# EAGLE design uradmonitor_D.100.61 (EAGLE 6.1)
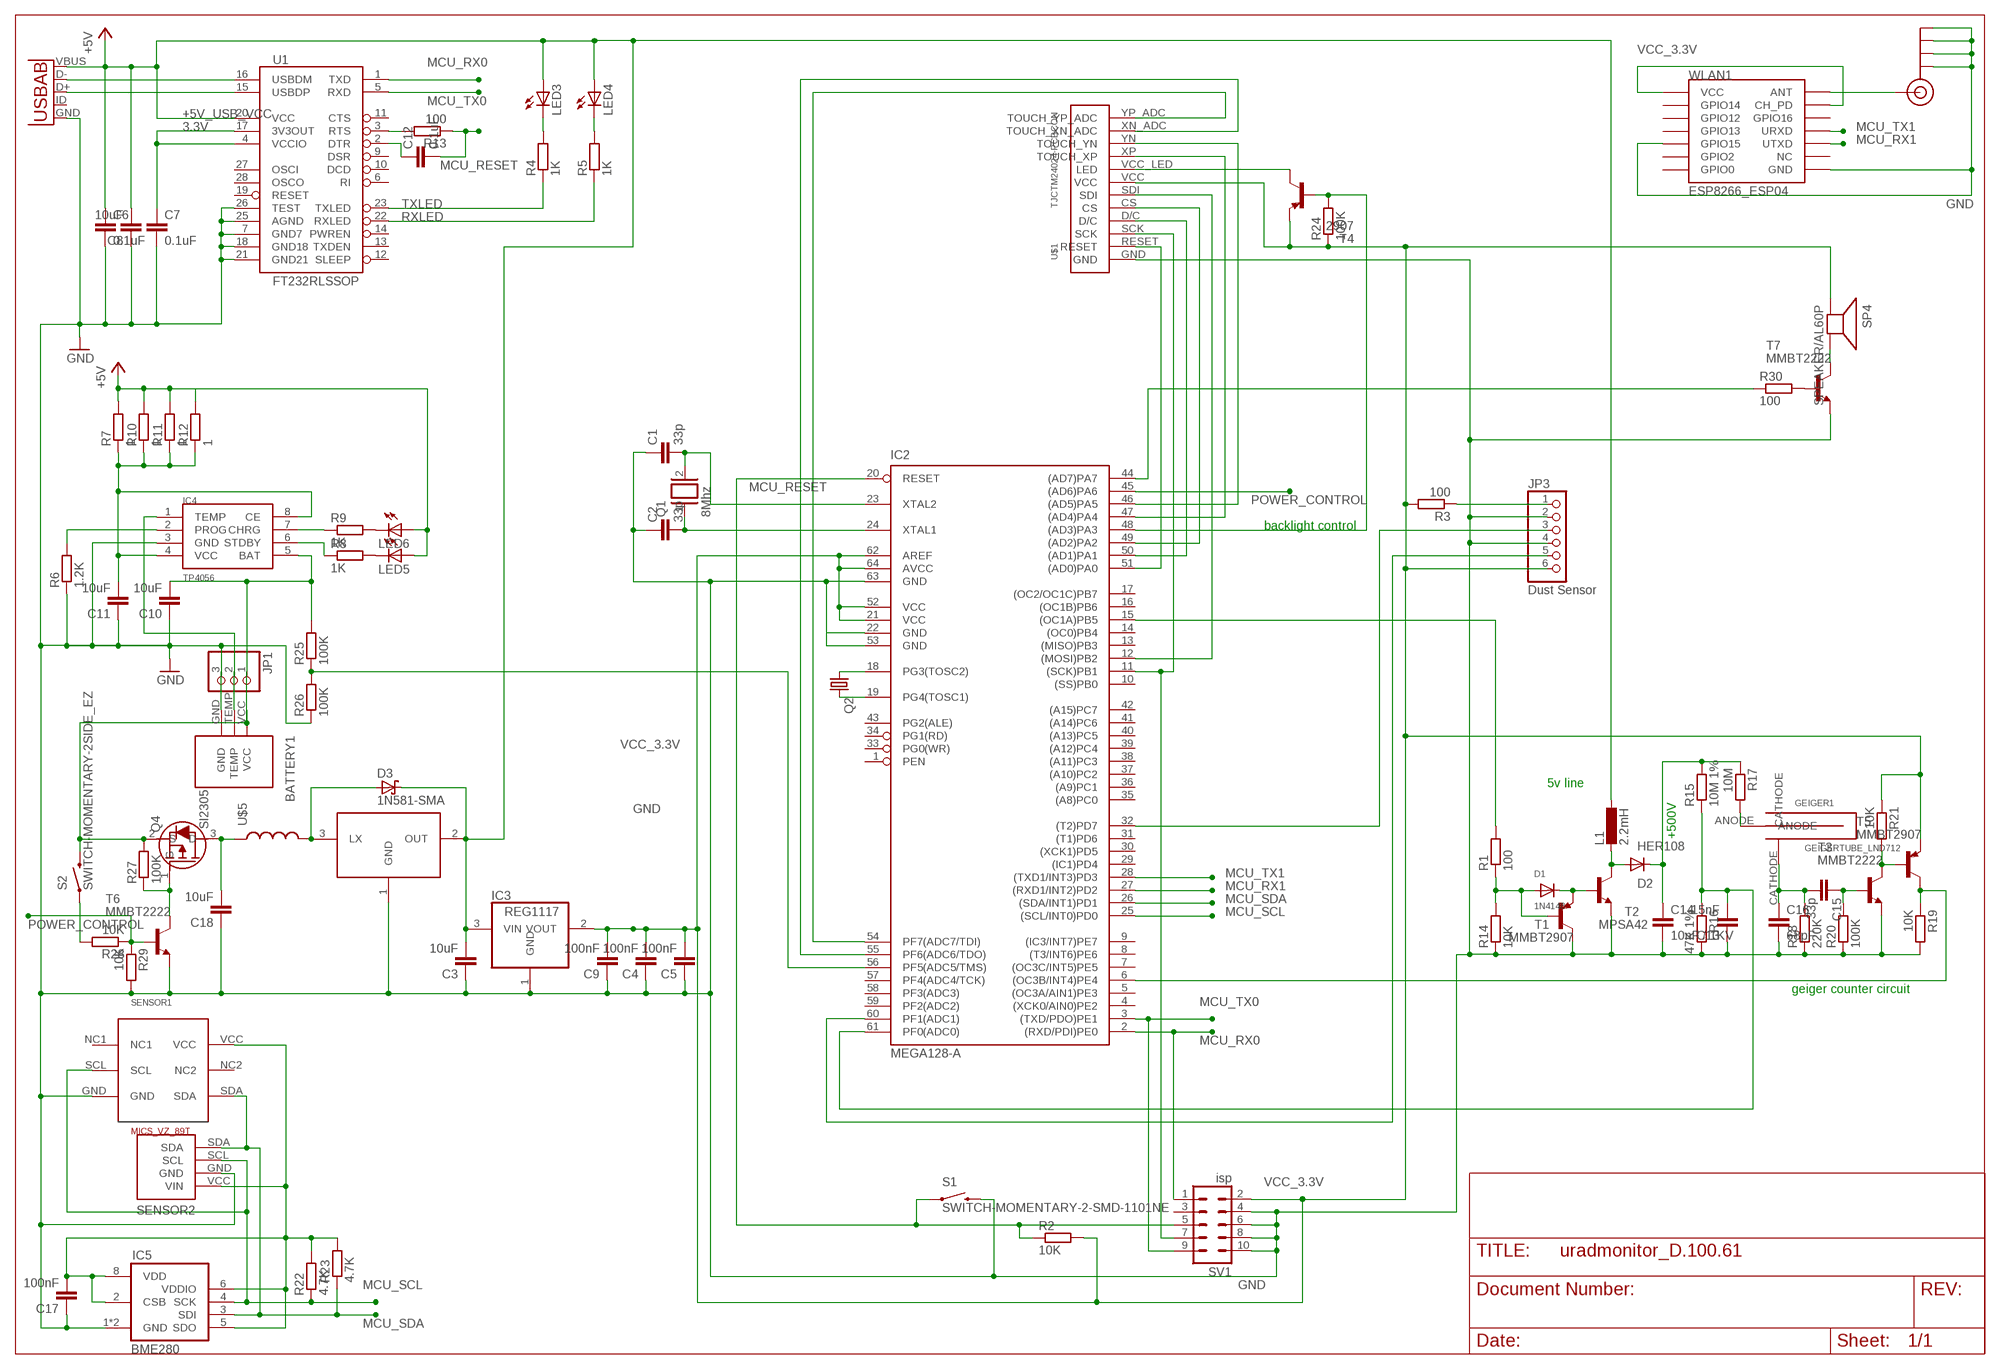
[diagram p0: schematic, sheet 1]

## Parts
BATTERY1  BAT-CASIO-NP40BATTERY  [BAT-CASIO-NP40]
C1  33p  C-EUC0805K  [C0805K]
C2  33p  C-EUC0805K  [C0805K]
C3  10uF  C-EUC0805K  [C0805K]
C4  100nF  C-EUC0805K  [C0805K]
C5  100nF  C-EUC0805K  [C0805K]
C6  0.1uF  CAP0805  [0805]
C7  0.1uF  CAP0805  [0805]
C8  10uF  C-EUC0805K  [C0805K]
C9  100nF  C-EUC0805K  [C0805K]
C10  10uF  C-EUC0805K  [C0805K]
C11  10uF  C-EUC0805K  [C0805K]
C12  0.1uF  CAP0805  [0805]
C13  15nF  C-EUC0805K  [C0805K]
C14  10nF / 1KV  C-EU050-025X075  [C050-025X075]
C15  33p  C-EUC0805K  [C0805K]
C16  68pF  C-EUC0805K  [C0805K]
C17  100nF  C-EUC0805K  [C0805K]
C18  10uF  C-EUC0805K  [C0805K]
D1  1N4148  DIODESOD-323F  [SOD-323F]
D2  HER108  DIODE-DO-214AC  [DO-214AC]
D3  1N581-SMA  [SMA-DIODE]
GEIGER1  GEIGERTUBE_LND712  [GEIGERTUBE_LND712]
IC2  MEGA128-A  [TQFP64]
IC3  REG1117  [SOT223]
IC4  TP4056  [TP4056]
IC5  BME280  [BME280]
J$1  SMA_EDGE  [SMA-EDGE]
JP1  PINHD-1X3  [1X03]
JP3  Dust Sensor  PINHD-1X6CB  [1X06-CLEANBIG]
L1  2.2mH  L-EUL1812  [L1812]
LED3  LEDCHIP-LED0805  [CHIP-LED0805]
LED4  LEDCHIP-LED0805  [CHIP-LED0805]
LED5  LED3MM  [LED3MM]
LED6  LED3MM  [LED3MM]
Q1  8Mhz  XTAL/S  [QS]
Q2  CRYSTALTC26H  [TC26H]
Q4  SI2305  [SOT23]
R1  100  R-EU_R0805  [R0805]
R2  10K  R-EU_R0805  [R0805]
R3  100  R-EU_R0805  [R0805]
R4  1K  R-EU_R0805  [R0805]
R5  1K  R-EU_R0805  [R0805]
R6  1.2K  R-EU_R0805  [R0805]
R7  1  R-EU_R0805  [R0805]
R8  1K  R-EU_R0805  [R0805]
R9  1K  R-EU_R0805  [R0805]
R10  1  R-EU_R0805  [R0805]
R11  1  R-EU_R0805  [R0805]
R12  1  R-EU_R0805  [R0805]
R13  100  R-EU_R0805  [R0805]
R14  10K  R-EU_R0805  [R0805]
R15  10M 1%  R-EU_0204/7  [0204/7]
R16  47K 1%  R-EU_R0805  [R0805]
R17  10M  R-EU_0204/7  [0204/7]
R18  220K  R-EU_0204/7  [0204/7]
R19  10K  R-EU_R0805  [R0805]
R20  100K  R-EU_R0805  [R0805]
R21  10K  R-EU_R0805  [R0805]
R22  4.7K  R-EU_R0805  [R0805]
R23  4.7K  R-EU_R0805  [R0805]
R24  100K  R-EU_R0805  [R0805]
R25  100K  R-EU_R0805  [R0805]
R26  100K  R-EU_R0805  [R0805]
R27  100K  R-EU_R0805  [R0805]
R28  10K  R-EU_R0805  [R0805]
R29  10K  R-EU_R0805  [R0805]
R30  100  R-EU_R0805  [R0805]
S1  SWITCH-MOMENTARY-2-SMD-1101NE  [TACTILE-SWITCH-1101NE]
S2  SWITCH-MOMENTARY-2SIDE_EZ  [TACTILE-PTH-SIDEEZ]
SENSOR1  MICS_VZ_89T  [MICS_VZ_89T]
SENSOR2  SENSOR_GY68GY-86DIP  [SENSOR_GY68]
SP4  SPEAKER/AL60P  [AL60P]
SV1  isp  MA05-2  [MA05-2]
T1  MMBT2907  MMBT2907ALT1-PNP-SOT23-BEC  [SOT23-BEC]
T2  MPSA42  MMBTA42LT1-NPN-SOT23-BEC  [SOT23-BEC]
T3  MMBT2222  MMBT2222ALT1-NPN-SOT23-BEC  [SOT23-BEC]
T4  2907  MMBT2907ALT1-PNP-SOT23-BEC  [SOT23-BEC]
T5  MMBT2907  MMBT2907ALT1-PNP-SOT23-BEC  [SOT23-BEC]
T6  MMBT2222  MMBT2222ALT1-NPN-SOT23-BEC  [SOT23-BEC]
T7  MMBT2222  MMBT2222ALT1-NPN-SOT23-BEC  [SOT23-BEC]
U1  FT232RLSSOP  [SSOP28DB]
U$1  TJCTM24024-PCBCON  [TJCTM24024-PCBCON]
U$2  USB_AB  [USB-AB-MICRO-SMD]
U$3  BL8530-SOT89-3  [SOT-89-3]
U$5  INDUCTOR-B82462G  [B82462G]
WLAN1  ESP8266_ESP04  [ESP8266_ESP04]

## Nets
3.3V [power]: C7.1 U1.4(VCCIO) U1.17(3V3OUT)
+5V_USB_VCC: C3.2 C6.1 C8.2 D3.C IC3.3(VIN) L1.1 LED3.A LED4.A LED5.A LED6.A R7.2 R10.2 R11.2 R12.2 U1.20(VCC) U$2.VBUS U$3.2(OUT) ; supply symbol labelled +5V
GND: BATTERY1.GND C1.1 C2.1 C3.1 C4.1 C5.1 C6.2 C7.2 C8.1 C9.1 C10.1 C11.1 C13.1 C14.2 C16.2 C17.1 C18.1 IC2.22(GND) IC2.53(GND) IC2.63(GND) IC3.1(GND) IC4.3(GND) IC5.1(GND) IC5.7(GND) J$1.GND@0(GND) J$1.GND@1(GND) J$1.GND@2(GND) J$1.GND@3(GND) JP1.3 JP3.2 JP3.4 R6.1 R14.1 R16.2 R18.1 R19.2 R20.1 R26.1 R29.2 S1.P$2 SENSOR1.GND SENSOR2.GND SV1.4 SV1.6 SV1.8 SV1.10 T1.C T2.E T3.E T6.E T7.E U1.7(GND7) U1.18(GND18) U1.21(GND21) U1.25(AGND) U1.26(TEST) U$1.GND U$2.GND U$3.1(GND) WLAN1.GND WLAN1.GPIO15
MCU_RESET: C12.2 IC2.20(RESET) R2.1 R13.1 S1.P$1 SV1.5
MCU_RX0: IC2.2((RXD/PDI)PE0) SV1.1 U1.1(TXD)
MCU_RX1: IC2.27((RXD1/INT2)PD2) WLAN1.UTXD
MCU_SCL: IC2.25((SCL/INT0)PD0) IC5.4(SCK) R22.1 SENSOR1.SCL SENSOR2.SCL
MCU_SDA: IC2.26((SDA/INT1)PD1) IC5.3(SDI) R23.1 SENSOR1.SDA SENSOR2.SDA
MCU_TX0: IC2.3((TXD/PDO)PE1) SV1.9 U1.5(RXD)
MCU_TX1: IC2.28((TXD1/INT3)PD3) WLAN1.URXD
N$1: J$1.SIG(SIGNAL) WLAN1.ANT
N$2: LED3.C R4.2
N$3: IC2.56(PF5(ADC5/TMS)) R25.1 R26.2
N$4: IC2.15((OC1A)PB5) R1.2
N$5: JP3.1 R3.1
N$6: IC2.11((SCK)PB1) SV1.7 U$1.SCK
N$7: LED4.C R5.2
N$8: D1.A R1.1 R14.2 T1.B
N$9: C1.2 IC2.23(XTAL2) Q1.2
N$11: C2.2 IC2.24(XTAL1) Q1.1
N$12: IC2.18(PG3(TOSC2)) Q2.1
N$13: T4.C U$1.VCC_LED(LED)
N$14: IC2.12((MOSI)PB2) U$1.SDI
N$15: U1.16(USBDM) U$2.D-
N$16: U1.15(USBDP) U$2.D+
N$17: D1.C T1.E T2.B
N$18: IC4.6(STDBY) R8.1
N$19: GEIGER1.ANODE R17.2
N$20: C15.1 R20.2 T3.B
N$21: IC4.7(CHRG) R9.1
N$22: LED6.K(C) R9.2
N$23: IC2.32((T2)PD7) JP3.3
N$24: LED5.K(C) R8.2
N$25: BATTERY1.VCC C10.2 IC4.5(BAT) JP1.1 Q4.2(S) R25.2 R27.2 S2.2
N$26: C12.1 U1.2(DTR)
N$27: IC4.2(PROG) R6.2
N$28: R13.2 U1.3(RTS)
N$29: C11.2 IC4.4(VCC) IC4.8(CE) R7.1 R10.1 R11.1 R12.1
N$30: IC2.19(PG4(TOSC1)) Q2.2
N$31: BATTERY1.TEMP IC4.1(TEMP) JP1.2
N$32: IC2.60(PF1(ADC1)) JP3.5
N$33: IC2.44((AD7)PA7) R30.1
N$35: D3.A U$3.3(LX) U$5.P$2
N$36: IC2.51((AD0)PA0) U$1.RESET
N$38: IC2.50((AD1)PA1) U$1.D/C
N$39: IC2.49((AD2)PA2) U$1.CS
N$40: IC2.47((AD4)PA4) U$1.XP(TOUCH_XP)
N$41: IC2.46((AD5)PA5) U$1.YN(TOUCH_YN)
N$42: C15.2 C16.1 GEIGER1.CATHODE R18.2
N$43: IC2.54(PF7(ADC7/TDI)) U$1.YP_ADC(TOUCH_YP_ADC)
N$44: IC2.55(PF6(ADC6/TDO)) U$1.XN_ADC(TOUCH_XN_ADC)
N$45: IC2.48((AD3)PA3) R24.2 T4.B
N$46: Q4.1(G) R27.1 T6.C
N$47: C18.2 Q4.3(D) U$5.P$1
N$48: R28.2 S2.1
N$51: D2.A L1.2 T2.C
N$54: C13.2 IC2.61(PF0(ADC0)) R15.1 R16.1
N$56: C14.1 D2.C R15.2 R17.1
N$57: R30.2 T7.B
N$59: R21.2 T3.C T5.B
N$60: IC2.6((OC3B/INT4)PE4) R19.1 T5.C
POWER_CONTROL: IC2.45((AD6)PA6) R28.1 R29.1 T6.B
RXLED: R5.1 U1.22(RXLED)
SOLDER_TUBE: SP4.2(-) T7.C
TXLED: R4.1 U1.23(TXLED)
VCC_3.3V: C4.2 C5.2 C9.2 C17.2 IC2.21(VCC) IC2.52(VCC) IC2.62(AREF) IC2.64(AVCC) IC3.2(VOUT) IC5.2(CSB) IC5.5(SDO) IC5.6(VDDIO) IC5.8(VDD) JP3.6 R2.2 R3.2 R21.1 R22.2 R23.2 R24.1 SENSOR1.VCC SENSOR2.VCC(VIN) SP4.1(+) SV1.2 T4.E T5.E U$1.VCC WLAN1.CH_PD WLAN1.VCC
Unconnected: IC2.1(PEN) IC2.4((XCK0/AIN0)PE2) IC2.5((OC3A/AIN1)PE3) IC2.7((OC3C/INT5)PE5) IC2.8((T3/INT6)PE6) IC2.9((IC3/INT7)PE7) IC2.10((SS)PB0) IC2.13((MISO)PB3) IC2.14((OC0)PB4) IC2.16((OC1B)PB6) IC2.17((OC2/OC1C)PB7) IC2.29((IC1)PD4) IC2.30((XCK1)PD5) IC2.31((T1)PD6) IC2.33(PG0(WR)) IC2.34(PG1(RD)) IC2.35((A8)PC0) IC2.36((A9)PC1) IC2.37((A10)PC2) IC2.38((A11)PC3) IC2.39((A12)PC4) IC2.40((A13)PC5) IC2.41((A14)PC6) IC2.42((A15)PC7) IC2.43(PG2(ALE)) IC2.57(PF4(ADC4/TCK)) IC2.58(PF3(ADC3)) IC2.59(PF2(ADC2)) SENSOR1.NC1 SENSOR1.NC2 SV1.3 U1.6(RI) U1.9(DSR) U1.10(DCD) U1.11(CTS) U1.12(SLEEP) U1.13(TXDEN) U1.14(PWREN) U1.19(RESET) U1.27(OSCI) U1.28(OSCO) U$2.ID(USBID) WLAN1.GPIO0 WLAN1.GPIO2 WLAN1.GPIO12 WLAN1.GPIO13 WLAN1.GPIO14 WLAN1.GPIO16 WLAN1.NC

## Notes on the sheet
- backlight control
- 5v line
- +500V
- geiger counter circuit

## Library data of the parts
BATTERY1 = uradmonitor:BAT-CASIO-NP40: Li-ion 3.7V 1500mAh battery , compatible with Casio-NP-40
C1-C5 C8-C11 C13-C18 = rcl:C-EU: CAPACITOR, European symbol
C6 C7 C12 = SparkFun:CAP: Capacitor Standard 0603 ceramic capacitor, and 0.1" leaded capacitor.
D1 = adafruit:DIODE: Diode SMADIODE - SMA Surface Mount Package 20V 1A Schottky Diode Digikey: 641-1014-6-ND DO-1N4148 - Through Hole Small Current Diode SOD-123 20V 1 A (.5mV Vf) Schottky Diode - Digikey: MBRX120TPMSCT-ND SOD-323 10V 570mA (.38mV Vf, 3ns) Schottky Diode - Digikey: ZLLS410CT-ND SOD-523 30V 30mA Schottky Diode (RB751S-40TE61) - Digikey: RB751S-40TE61CT-ND SOT23-R/W - SOT23 Package (R = Solder Paste/Reflow Ovens, W = Hand-Soldering) BAT54Film 40V 300mA - Digikey: 497-7162-1-ND
D2 = diode:DIODE-: DIODE
D3 = digital-toy:1N581*: 1.0A SCHOTTKY BARRIER RECTIFIER Source: http://www.diodes.com/datasheets/ds23001.pdf
GEIGER1 = uradmonitor:GEIGERTUBE_LND712
IC2 = atmel:MEGA128: MICROCONTROLLER 128 Kbytes FLASH 4 Kbytes SRAM 4 Kbytes EEPROM DUAL USART 8-channel 10 bit ADC Source: avr.lbr; MPN: ATMEGA128-16AU; OC_FARNELL: 9171118; OC_NEWARK: 95K7364
IC3 = burr-brown:REG1117: 800mA and 1A Low Dropout (LDO) Positive Regulator 1.8V, 2.5V, 2.85V, 3.3V, 5V, and Adj; MPN: REG1117; OC_FARNELL: 1097566; OC_NEWARK: 14P6981
IC4 = uradmonitor:TP4056
IC5 = uradmonitor:BME280: DIGITAL HUMIDITY, PRESSURE AND TEMPERATURE SENSOR * Digital interface IÂ²C (up to 3.4 MHz) and SPI (3 and 4 wire, up to 10 MHz)* Supply voltage VDD main supply voltage range: 1.71 V to 3.6 V*VDDIO interface voltage range: 1.2 V to 3.6 V Operating range -40â€¦+85 Â°C, 0â€¦100 % rel. humidity, 300â€¦1100 hPa
J$1 = sparkfun-connectors:SMA_EDGE: SMA Antenna Connector End launch SMA connector. The paste layer has been removed so that the connector can be hand soldered onto the board after reflow.
JP1 = adafruit:PINHD-1X3: PIN HEADER
JP3 = adafruit:PINHD-1X6: PIN HEADER
L1 = rcl:L-EU: INDUCTOR, European symbol
LED3-LED6 = adafruit:LED: LED OSRAM: - CHIPLED LG R971, LG N971, LY N971, LG Q971, LY Q971, LO R971, LY R971 LH N974, LH R974 LS Q976, LO Q976, LY Q976 LO Q996 - Hyper CHIPLED LW Q18S LB Q993, LB Q99A, LB R99A - SideLED LS A670, LO A670, LY A670, LG A670, LP A670 LB A673, LV A673, LT A673, LW A673 LH A674 LY A675 LS A676, LA A676, LO A676, LY A676, LW A676 LS A679, LY A679, LG A679 - Hyper Micro SIDELED® LS Y876, LA Y876, LO Y876, LY Y876 LT Y87S - SmartLED LW L88C, LW L88S LB L89C, LB L89S, LG L890 LS L89K, LO L89K, LY L89K LS L896, LA L896, LO L896, LY L896 - TOPLED LS T670, LO T670, LY T670, LG T670, LP T670 LSG T670, LSP T670, LSY T670, LOP T670, LYG T670 LG T671, LOG T671, LSG T671 LB T673, LV T673, LT T673, LW T673 LH T674 LS T676, LA T676, LO T676, LY T676, LB T676, LH T676, LSB T676, LW T676 LB T67C, LV T67C, LT T67C, LS T67K, LO T67K, LY T67K, LW E67C LS E67B, LA E67B, LO E67B, LY E67B, LB E67C, LV E67C, LT E67C LW T67C LS T679, LY T679, LG T679 LS T770, LO T770, LY T770, LG T770, LP T770 LB T773, LV T773, LT T773, LW T773 LH T774 LS E675, LA E675, LY E675, LS T675 LS T776, LA T776, LO T776, LY T776, LB T776 LHGB T686 LT T68C, LB T68C - Hyper Mini TOPLED® LB M676 - Mini TOPLED Santana® LG M470 LS M47K, LO M47K, LY M47K Source: http://www.osram.convergy.de/
Q1 = special:XTAL/S: CRYSTAL
Q2 = adafruit:CRYSTAL: CRYSTAL; OC_FARNELL: unknown; OC_NEWARK: unknown
Q4 = uradmonitor:SI2305: P-Channel 8 V (D-S) MOSFET
R1 R3 R14 R24 = resistor:R-EU_: RESISTOR, European symbol
R2 R4-R13 R15-R23 R25-R30 = rcl:R-EU_: RESISTOR, European symbol
S1 S2 = sparkfun-electromechanical:SWITCH-MOMENTARY-2: Various NO switches- pushbuttons, reed, etc
SENSOR1 = uradmonitor:MICS_VZ_89T: The MiCS-VZ-86/89 combines state-of-the-art MOS sensor technology with intelligent detection algorithms to monitor VOCs and CO2 equivalent variations in confined spaces
SENSOR2 = uradmonitor:SENSOR_GY68: GY-68 breadboard featuring 3.3V regulator and BMP180 sensor for 5V input.
SP4 = adafruit:SPEAKER: SPEAKER Source: Buerklin Added PS12 (for part # PS1240 piezo) http://www.ladyada.net/library/pcb/eaglelibrary.html
SV1 = con-lstb:MA05-2: PIN HEADER; OC_FARNELL: unknown; OC_NEWARK: unknown
T1 T4 T5 = transistor-neu-to92:*-PNP-: PNP Transistror
T2 T3 = transistor-neu-to92:*-NPN-: NPN Transistror BF959 corrected 2008.03.06
T6 T7 = transistor:*-NPN-: NPN Transistror BF959 corrected 2008.03.06
U1 = SparkFun:FT232RL: USB UART FT232RL 4th Generation USB UART (USB <-> Serial) Controller. Spark Fun Electronics SKU : COM-00650
U$1 = uradmonitor:TJCTM24024-PCBCON
U$2 = sparkfun-connectors:USB_AB: This is a USB AB connector that is compatible with USB OTG. i.e. this connector can serve as a host or device
U$3 = digital-toy:BL8530: PFC step-up DC boost for BL8530, rm04 and some other 3 pin boost. by hyl, 2011.4.11
U$5 = digital-toy:INDUCTOR: Inductors Basic Inductor/Choke - 0603 and 1206. Footprints are not proven and vary greatly between part numbers.
WLAN1 = uradmonitor:ESP8266_ESP04

## Net classes
1 power: width 0.254 mm

## Board
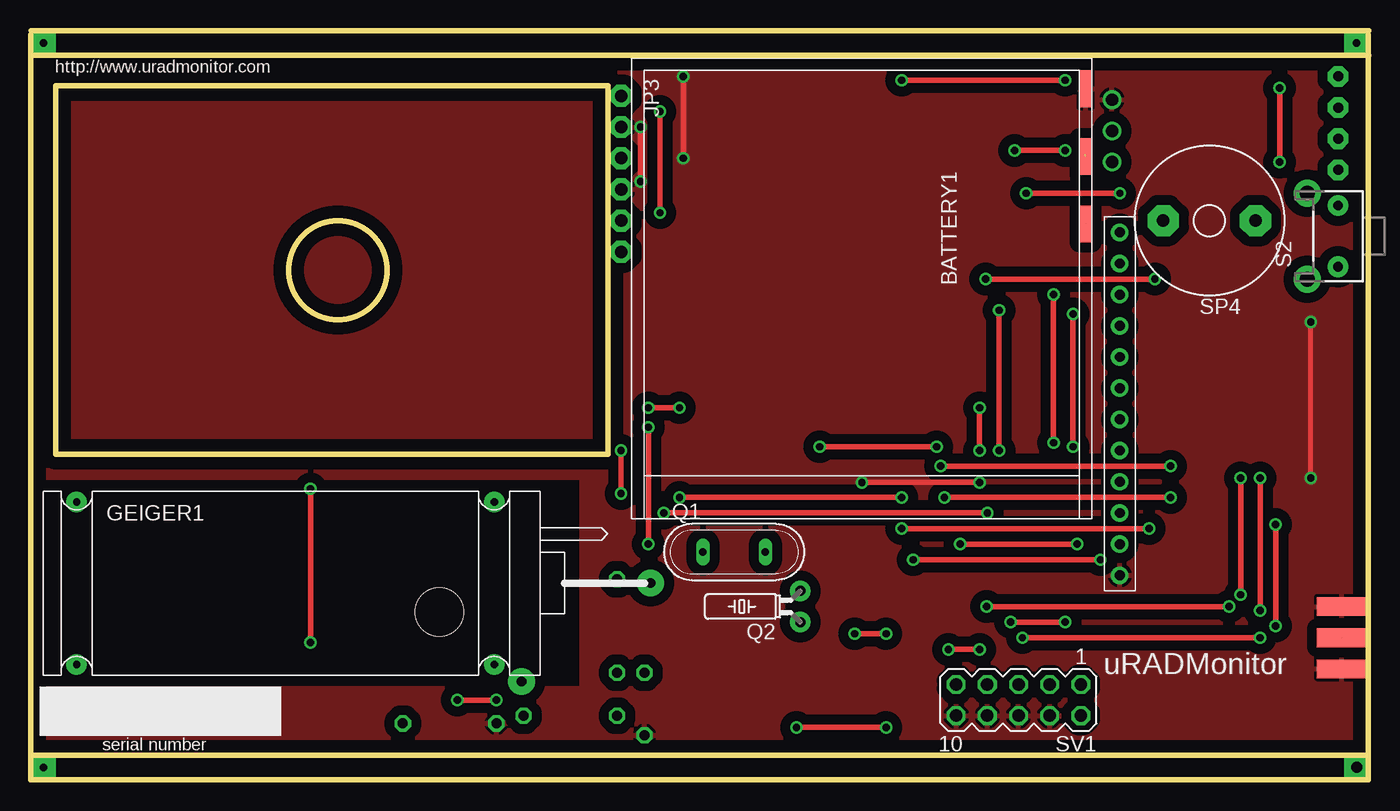
[diagram p1: board, top side]
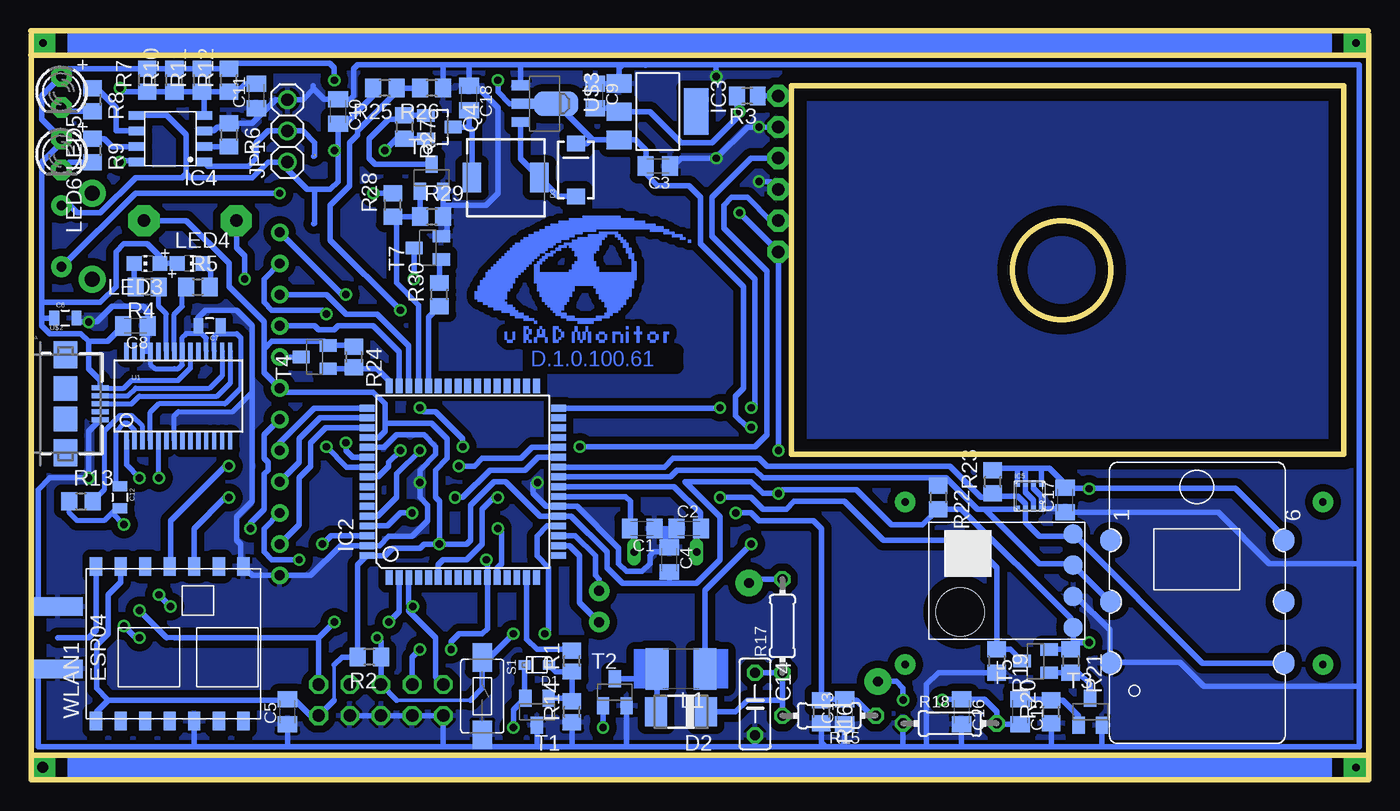
[diagram p2: board, bottom side, seen from below]

Size 109.03 x 61.03 mm. Coordinates in mm from the lower left corner, seen from the top.
Outline: 0,60.7 0,2
Outline: 0,2 0,0 109,0 109,2
Outline: 0,2 109,2
Outline: 0.03,61.03 54.53,61.03 109.03,61.03
Outline: 0.03,59.03 109.03,59.03
Outline: 109,2 109,60.7
Outline: 2.03,56.53 47.03,56.53 47.03,26.53 2.03,26.53 2.03,56.53
Outline: circle at 25.03,41.53 radius 4
Copper layers (1*16): Top 0.035mm / dielectric 1.5mm / Bottom 0.035mm
Design rules: minimum track width 10mil, minimum drill 24mil, track to track 8mil, track to pad 8mil, pad to pad 8mil, via to via 8mil, smd to smd 8mil, copper to edge 40mil, drill to drill 8mil, minimum pad ring 10mil, minimum via ring 8mil, stop-mask expansion 4mil, vias tented up to drill 0mil, thermal gap 10mil
Milling: area 2,26.5 to 47,56.5

### Footprints (pad centres in the part's own frame; a part is rotated, then mirrored left to right if it is on the bottom)
BAT-CASIO-NP40 = smd 3 x 1: GND 34.59,-36.85; TEMP 29.09,-36.85; VCC 23.59,-36.85
C0805K = smd 1.3 x 1.6: 1 -1,0; 2 1,0
0805 = smd 0.8 x 1.2: 1 -0.9,0; 2 0.9,0
C050-025X075 = drill 0.813 octagon: 1 -2.54,0; 2 2.54,0
SOD-323F = smd 1 x 0.8: A -1,0; C 1,0
DO-214AC = smd 1.8 x 2.4: A 2.025,0; C -2.025,0
SMA-DIODE = smd 1.27 x 1.47: A -2.15,0; C 2.15,0
GEIGERTUBE_LND712 = drill 0.8 pad 2.184: ANODE 49.61,-7.57; CATHODE 39.11,-15.58
TQFP64 = smd 1.194 x 0.559: 1 -7.8,6; 2 -7.8,5.2; 3 -7.8,4.4; 4 -7.8,3.6; 5 -7.8,2.8; 6 -7.8,2; 7 -7.8,1.2; 8 -7.8,0.4; 9 -7.8,-0.4; 10 -7.8,-1.2; 11 -7.8,-2; 12 -7.8,-2.8; 13 -7.8,-3.6; 14 -7.8,-4.4; 15 -7.8,-5.2; 16 -7.8,-6; 33 7.8,-6; 34 7.8,-5.2; 35 7.8,-4.4; 36 7.8,-3.6; 37 7.8,-2.8; 38 7.8,-2; 39 7.8,-1.2; 40 7.8,-0.4; 41 7.8,0.4; 42 7.8,1.2; 43 7.8,2; 44 7.8,2.8; 45 7.8,3.6; 46 7.8,4.4; 47 7.8,5.2; 48 7.8,6 | smd 0.559 x 1.194: 17 -6,-7.8; 18 -5.2,-7.8; 19 -4.4,-7.8; 20 -3.6,-7.8; 21 -2.8,-7.8; 22 -2,-7.8; 23 -1.2,-7.8; 24 -0.4,-7.8; 25 0.4,-7.8; 26 1.2,-7.8; 27 2,-7.8; 28 2.8,-7.8; 29 3.6,-7.8; 30 4.4,-7.8; 31 5.2,-7.8; 32 6,-7.8; 49 6,7.8; 50 5.2,7.8; 51 4.4,7.8; 52 3.6,7.8; 53 2.8,7.8; 54 2,7.8; 55 1.2,7.8; 56 0.4,7.8; 57 -0.4,7.8; 58 -1.2,7.8; 59 -2,7.8; 60 -2.8,7.8; 61 -3.6,7.8; 62 -4.4,7.8; 63 -5.2,7.8; 64 -6,7.8
SOT223 = smd 1.499 x 2.007: 1 -2.261,-3.15; 2 0.025,-3.15; 3 2.311,-3.15 | smd 3.81 x 2.007: 4 0,3.15
TP4056 = smd 1.3 x 0.7: 1 -2.75,1.905; 2 -2.75,0.635; 3 -2.75,-0.635; 4 -2.75,-1.905; 5 2.75,-1.905; 6 2.75,-0.635; 7 2.75,0.635; 8 2.75,1.905
BME280 = smd 0.35 x 0.5: 1 0.975,-1.025; 2 0.325,-1.025; 3 -0.325,-1.025; 4 -0.975,-1.025; 5 -0.975,1.025; 6 -0.325,1.025; 7 0.325,1.025; 8 0.975,1.025
SMA-EDGE = smd 1.524 x 4.064: GND@0 0,0; GND@1 5.08,0; SIG 2.54,0 | smd 1.524 x 4.064 bottom: GND@2 0,0; GND@3 5.08,0
1X03 = drill 1.016: 1 -2.54,0; 2 0,0; 3 2.54,0
1X06-CLEANBIG = drill 1.016 pad 1.778 octagon: 1 -6.35,0; 2 -3.81,0; 3 -1.27,0; 4 1.27,0; 5 3.81,0; 6 6.35,0
L1812 = smd 1.9 x 3.4: 1 -1.95,0; 2 1.95,0
CHIP-LED0805 = smd 1.2 x 1.2: A 0,-1.05; C 0,1.05
LED3MM = drill 0.813 pad 1.676 octagon: A -1.27,0; K 1.27,0
QS = drill 0.61 long: 1 -2.54,0; 2 2.54,0
TC26H = drill 0.813 pad 1.676: 1 -1.27,0; 2 1.27,0
SOT23 = smd 1 x 1.4: 1 -0.95,-1.1; 2 0.95,-1.1; 3 0,1.1
R0805 = smd 1.3 x 1.5: 1 -0.85,0; 2 0.85,0
R0805' = smd 1.3 x 1.5: 1 -0.95,0; 2 0.95,0
0204/7 = drill 0.813 octagon: 1 -3.81,0; 2 3.81,0
TACTILE-SWITCH-1101NE = smd 2.3 x 1.6: P$1 -3.15,0; P$2 3.15,0
TACTILE-PTH-SIDEEZ = drill 0.8 pad 1.7: 1 -2.5,0; 2 2.5,0 | drill 1.2 pad 2.2: ANCHOR1 -3.5,2.5; ANCHOR2 3.5,2.5
MICS_VZ_89T = smd 1.778 x 1.778: GND 16.349,-14.182; NC1 6.35,-14.183; NC2 11.356,-0.1; SCL 11.349,-14.183; SDA 16.351,-0.113; VCC 6.345,-0.105
SENSOR_GY68 = smd 1.524 x 1.524: GND 0.953,-3.493; SCL 0.953,-6.032; SDA 0.953,-8.572; VCC 0.953,-0.953 | hole 3.937: 10.16,-2.223
AL60P = drill 1.016 pad 2.54 octagon: 1 -3.759,0; 2 3.759,0
MA05-2 = drill 1.016 octagon: 1 -5.08,-1.27; 2 -5.08,1.27; 3 -2.54,-1.27; 4 -2.54,1.27; 5 0,-1.27; 6 0,1.27; 7 2.54,-1.27; 8 2.54,1.27; 9 5.08,-1.27; 10 5.08,1.27
SOT23-BEC = smd 1 x 1.4: B -0.95,-1.1; C 0,1.1; E 0.95,-1.1
SSOP28DB = smd 0.348 x 1.397: 1 -4.225,-3.656; 2 -3.575,-3.656; 3 -2.925,-3.656; 4 -2.275,-3.656; 5 -1.625,-3.656; 6 -0.975,-3.656; 7 -0.325,-3.656; 8 0.325,-3.656; 9 0.975,-3.656; 10 1.625,-3.656; 11 2.275,-3.656; 12 2.925,-3.656; 13 3.575,-3.656; 14 4.225,-3.656; 15 4.225,3.656; 16 3.575,3.656; 17 2.925,3.656; 18 2.275,3.656; 19 1.625,3.656; 20 0.975,3.656; 21 0.325,3.656; 22 -0.325,3.656; 23 -0.975,3.656; 24 -1.625,3.656; 25 -2.275,3.656; 26 -2.925,3.656; 27 -3.575,3.656; 28 -4.225,3.656
TJCTM24024-PCBCON = drill 0.8 pad 1.422: CS -20.32,0; D/C -22.86,0; GND -30.48,0; RESET -27.94,0; SCK -25.4,0; SDI -17.78,0; VCC -15.24,0; VCC_LED -12.7,0; XN_ADC -5.08,0; XP -10.16,0; YN -7.62,0; YP_ADC -2.54,0
USB-AB-MICRO-SMD = smd 1.4 x 0.4: D+ 2.85,0; D- 2.85,0.65; GND 2.85,-1.3; ID 2.85,-0.65; VBUS 2.85,1.3 | smd 1.9 x 2: P$6 0,1.25; P$7 0,-1.25 | smd 1.9 x 2.2: P$8 0,4; P$9 0,-4
SOT-89-3 = smd 0.8 x 1.4: 1 -1.499,-1.981; 3 1.499,-1.981 | smd 0.8 x 1.9: 2 0,-1.727 | smd 2.032 x 3.65: 2@1 0,0.94
B82462G = smd 2.4 x 1.5: P$1 0,2.75; P$2 0,-2.75
ESP8266_ESP04 = smd 1.5 x 1: ANT 7.4,4.8; CH_PD 7.4,2.8; GND 7.4,-7.2; GPIO0 -5.2,-7.2; GPIO2 -5.2,-5.2; GPIO12 -5.2,0.8; GPIO13 -5.2,-1.2; GPIO14 -5.2,2.8; GPIO15 -5.2,-3.2; GPIO16 7.4,0.8; NC 7.4,-5.2; URXD 7.4,-1.2; UTXD 7.4,-3.2; VCC -5.2,4.8

### Placement (x,y rotation side)
BATTERY1  49.11,21.7 90 top
C1  59.22,20.48 180 bottom
C2  55.41,20.48 0 bottom
C3  57.95,50.01 180 bottom
C4  56.99,17.94 270 bottom
C5  88.11,5.56 90 bottom
C6  106.21,37.62 0 bottom
C7  94.46,36.99 180 bottom
C8  100.49,36.99 180 bottom
C9  63.03,55.72 270 bottom
C10  83.98,54.45 270 bottom
C11  90.65,55.72 90 bottom
C12  101.76,23.02 270 bottom
C13  42.7,5.56 90 bottom
C14  50.01,6.19 270 bottom
C15  28.42,5.56 270 bottom
C16  33.18,5.56 270 bottom
C17  24.74,22.8 90 bottom
C18  73.3,55.55 270 bottom
D1  67.79,9.37 180 bottom
D2  56.04,5.56 180 bottom
D3  64.61,49.69 90 bottom
GEIGER1  0.89,23.61 0 top
IC2  73.82,24.29 90 bottom
IC3  57.95,54.45 270 bottom
IC4  97.63,52.23 180 bottom
IC5  27.64,23.13 0 bottom
J$1  106.84,9.05 90 top
JP1  88.11,52.86 90 bottom
JP3  48.1,49.37 270 top
L1  56.04,9.05 180 bottom
LED3  99.54,42.07 90 bottom
LED4  96.05,42.07 270 bottom
LED5  106.52,56.04 270 bottom
LED6  106.52,50.96 270 bottom
Q1  57.31,18.58 0 top
Q2  62.71,14.13 90 top
Q4  75.72,53.18 270 bottom
R1  64.93,9.69 90 bottom
R2  10K  [R0805']  81.44,10 180 bottom
R3  50.64,55.72 180 bottom
R4  1K  [R0805']  99.54,40.17 180 bottom
R5  1K  [R0805']  95.41,40.17 0 bottom
R6  1.2K  [R0805']  92.87,52.55 270 bottom
R7  1  [R0805']  99.54,56.99 90 bottom
R8  1K  [R0805']  103.98,55.41 270 bottom
R9  1K  [R0805']  103.98,51.28 270 bottom
R10  1  [R0805']  97.31,56.99 90 bottom
R11  1  [R0805']  95.09,56.99 90 bottom
R12  1  [R0805']  92.87,56.99 90 bottom
R13  100  [R0805']  104.94,22.7 0 bottom
R14  64.93,5.56 90 bottom
R15  43.97,5.24 180 bottom
R16  47K 1%  [R0805']  44.61,5.56 270 bottom
R17  47.78,12.54 90 bottom
R18  34.13,4.61 0 bottom
R19  10K  [R0805']  30.32,9.69 270 bottom
R20  100K  [R0805']  25.88,5.56 90 bottom
R21  10K  [R0805']  24.29,9.69 270 bottom
R22  4.7K  [R0805']  35.09,23.02 270 bottom
R23  4.7K  [R0805']  30.64,24.29 90 bottom
R24  82.71,34.45 270 bottom
R25  100K  [R0805']  80.17,56.36 180 bottom
R26  100K  [R0805']  76.36,56.36 180 bottom
R27  100K  [R0805']  78.58,53.18 270 bottom
R28  10K  [R0805']  79.53,46.83 90 bottom
R29  10K  [R0805']  76.36,45.88 0 bottom
R30  100  [R0805']  75.72,39.53 90 bottom
S1  72.23,6.83 270 bottom
S2  106.52,44.29 90 top
SENSOR1  6.82,25.87 270 bottom
SENSOR2  23.14,11.47 180 bottom
SP4  96.05,45.56 180 top
SV1  80.49,6.51 180 top
T1  67.79,5.56 180 bottom
T2  61.44,7.14 0 bottom
T3  22.7,5.56 0 bottom
T4  85.89,34.45 90 bottom
T5  27.15,9.69 90 bottom
T6  76.36,49.06 0 bottom
T7  76.68,43.34 90 bottom
U1  97,31.27 0 bottom
U$1  88.74,47.15 90 top
U$2  106.21,30.64 0 bottom
U$3  67.15,55.09 270 bottom
U$5  70.33,49.06 90 bottom
WLAN1  98.9,10 90 bottom

### Tracks (layer width: path | path; a pad name or v marks a point on that pad's centre or on a via)
3.3V
  Bottom 0.406: U1.17 94.07,36.11 93.82,36.36 93.5,36.36 | U1.4 99.27,29.95 98.59,30.64 93.19,30.64 91.92,31.91 91.92,36.04 92.23,36.36 93.5,36.36 | C7.1 93.56,36.41 93.5,36.36
+5V_USB_VCC  (via drill 0.6)
  Top 0.457: v70.96,56.99 v84.3,56.99 | v50.33,28.73 v50.33,19.21
  Bottom 0.406: 103.38,31.94 U$2.VBUS 103.33,31.91 101.44,31.91 100.81,32.55 97,32.55 96.02,33.52 U1.20
  Bottom 0.457: 106.21,57.62 LED5.A | LED5.A 108.11,55.72 108.11,53.82 LED6.A 106.52,51.91 108.11,50.33 108.11,38.9 | LED5.A 105.89,57.94 R7.2 R10.2 R11.2 R12.2 | U$2.VBUS 103.36,32.55 104.3,33.5 104.3,35.72 | 104.3,35.72 104.94,36.36 107.47,36.36 108.11,36.99 108.11,37.62 | C6.1 108.11,37.62 | v84.3,56.99 84.3,58 84.69,58.39 92.41,58.39 R12.2 | R12.2 92.88,57.92 | v70.96,56.99 70.96,56.04 70.01,55.09 U$3.2 66.2,55.09 63.34,52.23 | 63.34,52.23 63.25,52.14 IC3.3 59.76,52.14 58.9,51.28 58.9,50.06 C3.2 58.95,49.42 57.95,48.42 55.41,48.42 54.45,47.47 54.45,43.66 50.96,40.17 50.96,31.91 51.59,31.27 51.59,29.69 50.64,28.73 v50.33,28.73 | L1.1 54.09,15.45 v50.33,19.21 | 108.11,38.9 108.11,37.62 | LED4.A LED3.A 98.49,42.61 99.54,43.66 101.44,43.66 102.08,43.02 102.08,40.17 103.35,38.9 108.11,38.9 | 104.3,35.72 102.76,35.72 C8.2 | D3.C 63.73,51.84 63.34,52.23
GND  (via drill 0.6)
  Top 0.406: v104.3,24.61 v104.3,37.31
  Top 0.457: v77.31,24.23 v67.73,24.23 | v49.69,48.74 v49.69,53.18 | v53.18,50.64 v53.18,57.31
  Bottom 0.406: U1.26 U1.25 99.27,33.87 98.9,33.5 97.31,33.5 | 97.31,33.5 97,33.5 96.68,33.81 U1.21 96.67,36.05 96.36,36.36 95.41,36.36 | 97.32,33.49 97.31,33.5 | U1.7 97.32,29.68 97,30.01 92.55,30.01 90.97,31.59 | v104.3,24.61 104.62,24.61 | U1.18 94.72,35.98 95.09,36.36 95.41,36.36 | C7.2 95.36,36.41 95.41,36.36 | U$2.GND 103.38,29.34 103.67,29.05
  Bottom 0.457: SV1.4 SV1.6 SV1.8 SV1.10 75.41,2.7 | 57.31,20.48 C1.1 | 92.23,53.18 92.55,53.5 | R6.1 92.56,53.5 93.19,53.5 93.5,53.18 93.82,53.18 94.14,52.86 IC4.3 | 92.55,53.5 R6.1 | IC5.7 27.32,23.77 26.68,23.13 IC5.1 25.04,22.1 C17.1 12.28,21.8 8.1,17.62 0.8,17.62 | SENSOR1.GND 21.14,9.52 | 21.19,9.64 SENSOR1.GND | 21.13,9.58 15.38,9.58 13.45,7.64 0.98,7.64 0.8,7.46 | 21.19,9.58 21.13,9.58 | 21.13,9.58 SENSOR1.GND | 0.8,7.46 0.8,2.7 22.38,2.7 | 0.8,7.46 0.8,17.62 | 0.8,17.62 0.8,58.26 53.18,58.26 | 53.18,58.26 58.9,58.26 | 58.9,58.26 60.8,58.26 | 60.8,58.26 69.06,58.26 | 69.06,58.26 73.19,58.26 | 73.19,58.26 75.09,58.26 | 22.38,2.7 25.88,2.7 | 25.88,2.7 33.18,2.7 | 33.18,2.7 36.04,2.7 | 36.04,2.7 37.94,2.7 | 37.94,2.7 43.02,2.7 | 43.02,2.7 44.29,2.7 | 44.29,2.7 50.01,2.7 | 50.01,2.7 60.48,2.7 | 60.48,2.7 64.93,2.7 | 64.93,2.7 67.79,2.7 | 67.79,2.7 72.23,2.7 | 72.23,2.7 75.41,2.7 | 75.41,2.7 88.11,2.7 | 88.11,2.7 95.73,2.7 | 95.73,2.7 108.43,2.7 108.43,9.05 J$1.GND@0 | 92.55,53.5 R6.1 | SENSOR2.GND 23.85,14.96 21.12,12.23 21.12,9.57 SENSOR1.GND | T3.E 21.75,2.7 22.38,2.7 | R20.1 25.88,2.7 | C16.2 33.18,2.7 | R18.1 37.94,2.7 | R19.2 35.08,8.73 36.04,7.78 36.04,2.7 | T1.C 67.79,2.7 | R14.1 64.93,2.7 | T2.E 60.49,2.7 60.48,2.7 | C2.1 57.31,20.48 | 57.31,20.48 57.31,19.26 C4.1 57.36,18.58 58.26,18.58 58.58,18.26 58.58,17.62 59.22,16.99 60.48,16.99 61.12,17.62 61.12,18.89 64.52,22.29 IC2.22 67.06,22.29 68.11,23.34 68.11,24.18 v67.73,24.23 | C14.2 50.01,2.7 | R16.2 44.61,3.02 44.29,2.7 | C13.1 42.7,3.02 43.02,2.7 | S1.P$2 72.23,2.7 | 92.55,53.5 90.97,53.5 90.01,54.45 | WLAN1.GPIO15 95.7,2.73 95.73,2.7 | J$1.GND@1 108.43,14.13 108.43,23.66 107.47,24.61 104.62,24.61
  Bottom 0.457: C11.1 90.33,54.77 90.01,54.45 | C7.2 95.41,37.04 95.41,37.62 94.78,38.26 92.23,38.26 90.97,36.99 90.97,31.59 90.97,22.7 92.23,21.43 92.23,19.53 91.92,19.21 91.92,17.62 WLAN1.GND | v104.3,24.61 104.3,28.42 103.67,29.05 | U1.25 99.54,35.2 99.54,36.94 C8.1 99.49,38.21 99.86,38.58 102.39,38.58 103.67,37.31 v104.3,37.31 104.99,37.31 C6.2 | C6.2 105.31,37.89 | 105.25,37.94 105.25,37.68 C6.2 | WLAN1.GND 91.6,17.51 | WLAN1.GND 90.97,16.67 U$1.GND 86.2,16.67 83.78,19.09 IC2.63 80.61,19.09 79.85,19.84 77.95,19.84 76.68,21.12 76.68,22.38 77.31,23.02 v77.31,24.23 77.31,25.24 76.04,26.51 76.04,27.15 77,28.1 79.22,28.1 80.23,27.09 IC2.53 | JP3.4 48.74,48.74 v49.69,48.74 | JP3.2 v49.69,53.18 50.64,53.18 v53.18,50.64 56.04,50.64 56.67,50.01 C3.1 | C5.1 88.11,2.7 | R26.1 75.41,58.27 75.09,58.26 | 90.01,54.45 89.06,55.41 JP1.3 86.84,55.41 BATTERY1.GND | 86.01,56.55 86.01,56.34 BATTERY1.GND | 60.8,58.26 61.09,57.97 IC3.1 63.02,56.71 C9.1 | 75.09,58.26 82.39,58.26 82.71,57.95 82.71,55.72 82.98,55.45 C10.1 | C10.1 85.12,55.45 BATTERY1.GND | 83.98,55.41 C10.1 | 73.19,58.26 73.3,58.14 C18.1 73.19,56.67 72.87,56.36 72.55,56.36 70.96,54.77 70.96,47.78 71.92,46.83 75.41,46.83 75.41,47.15 T6.E R29.2 75.09,45.56 75.09,44.78 T7.E | U$3.1 69.13,58.19 69.06,58.26 | 58.95,58.22 58.9,58.26 | v53.18,57.31 53.18,58.26
  pour Bottom (isolate 0.61): 0.16,61.12 0.16,0.16 108.75,0.16 108.75,61.12
  pour Top (isolate 0.813): 0.16,7.46 44.93,7.46 44.93,24.61 0.16,24.61 0.16,60.8 108.75,60.8 108.75,0.48 0.16,0.48
MCU_RESET  (via drill 0.6)
  Top 0.457: v67.15,11.91 v69.69,11.91 | v80.81,11.59 v100.17,11.59 | v101.44,12.54 v101.44,20.8
  Bottom 0.305: 73.19,6.51 79.22,6.51
  Bottom 0.406: C12.2 102.03,22.12 102.39,21.75 103.03,21.12 105.25,21.12 105.89,21.75 R13.1
  Bottom 0.457: IC2.20 66.94,20.69 67.79,19.84 67.79,18.26 66.84,17.3 66.84,12.23 v67.15,11.91 | 72.21,10 S1.P$1 | S1.P$1 72.23,7.46 73.19,6.51 | 79.22,6.51 SV1.5 R2.1 80.49,11.27 v80.81,11.59 | v69.69,11.91 71.6,10 72.23,10 S1.P$1 | v100.17,11.59 100.49,11.59 v101.44,12.54 | v101.44,20.8 102.39,21.75
MCU_RX0  (via drill 0.6)
  Top 0.457: v79.85,12.86 v84.3,12.86 | v100.17,13.81 v100.17,24.61
  Bottom 0.406: 97.31,11.59 97.95,11.59
  Bottom 0.457: IC2.2 79.02,13.69 v79.85,12.86 | v84.3,12.86 85.57,11.59 | 85.57,11.59 SV1.1 | U1.1 101.22,25.66 v100.17,24.61 | 85.57,11.59 97.31,11.59 | 97.95,11.59 v100.17,13.81
MCU_RX1  (via drill 0.6)
  Top 0.457: v74.45,23.02 v92.87,23.02
  Bottom 0.457: IC2.27 67.69,26.29 68.74,25.24 71.6,25.24 73.82,23.02 v74.45,23.02 | v92.87,23.02 93.19,23.02 95.73,20.48 95.73,17.43 WLAN1.UTXD
MCU_SCL
  Bottom 0.457: 35.4,24.61 34.45,24.61 31.91,22.07 31.27,22.07 | R22.1 35.09,24.29 35.4,24.61 | SENSOR1.SCL 21.11,14.52 SENSOR2.SCL 24.21,17.62 26.83,17.62 31.27,22.07 | 31.27,22.07 28.65,22.07 IC5.4 | 35.4,24.61 49.37,24.61 50.01,25.24 56.36,25.24 56.91,24.69 IC2.25
MCU_SDA
  Bottom 0.457: 30.85,23.13 R23.1 | R23.1 30.43,23.13 28.61,23.13 27.97,22.48 IC5.3 27.97,20.98 26.83,19.84 24.29,19.84 SENSOR2.SDA 13.57,9.52 SENSOR1.SDA | R23.1 30.96,23.02 31.59,23.02 34.13,25.56 49.06,25.56 49.69,26.2 56.67,26.2 57.38,25.49 IC2.26
MCU_TX0  (via drill 0.6)
  Top 0.457: v98.59,24.61 v98.59,15.08 | v97.63,14.13 v77.9,14.13
  Bottom 0.406: U1.5 98.62,24.65 v98.59,24.61
  Bottom 0.457: SV1.9 76.04,8.41 76.04,11.59 78.22,13.77 78.22,13.81 v77.9,14.13 77.95,14.13 78.22,14.4 IC2.3 | v98.59,15.08 v97.63,14.13
MCU_TX1  (via drill 0.6)
  Top 0.457: v74.14,25.56 v92.87,25.56
  Bottom 0.457: IC2.28 68.16,27.09 69.06,26.2 72.23,26.2 72.87,25.56 v74.14,25.56 | v92.87,25.56 93.19,25.56 97.63,21.12 97.63,17.47 WLAN1.URXD
N$1  (1 unrouted)
  Bottom 0.457: WLAN1.ANT 103.7,12.19 104.3,11.59 J$1.SIG
N$2
  Bottom 0.457: LED3.C 100.59,40.27 R4.2
N$3  (via drill 0.6)
  Top 0.457: v78.9,38.26 v78.9,26.83
  Bottom 0.457: R26.2 R25.1 | R25.1 | v78.9,38.26 84.61,43.97 84.61,46.83 83.03,48.42 83.03,51.91 82.39,52.55 82.39,52.86 79.53,55.72 79.53,56.04 R25.1 | IC2.56 80.72,24.69 79.85,25.56 79.85,25.88 v78.9,26.83
N$4
  Bottom 0.457: 65.25,10.64 64.93,10.32 R1.2 | R1.2 64.93,10.64 | IC2.15 68.62,11.47 67.79,10.64 65.03,10.64 R1.2
N$5
  Bottom 0.457: JP3.1 49.69,55.72 R3.1 50.01,55.72
N$6  (via drill 0.6)
  Top 0.457: v74.77,10.64 v77.31,10.64 | v87.16,17.94 v71.92,17.94
  Bottom 0.457: v77.31,10.64 77.95,10 SV1.7 | v71.92,17.94 71.82,17.84 IC2.11 71.82,12.32 72.23,11.91 74.14,11.91 74.77,11.27 v74.77,10.64 | v87.16,17.94 89.38,17.94 90.01,18.58 90.01,20.48 U$1.SCK
N$7
  Bottom 0.457: R5.2 94.36,40.27 94.36,41.44 LED4.C
N$8
  Bottom 0.457: T1.B 65.18,6.66 R14.2 R1.1 66.25,8.84 D1.A
N$9
  Bottom 0.457: Q1.2 59.85,20.12 C1.2 60.17,20.53 60.17,22.7 60.56,23.09 IC2.23
N$10  (via drill 0.6 pad 1.68)
  other vias: 37.76,22.64
N$11
  Bottom 0.457: Q1.1 54.77,20.12 C2.2 | IC2.24 56.59,23.89 54.45,21.75 54.45,20.48 C2.2 | 54.45,20.53 C2.2
N$12
  Bottom 0.457: IC2.18 65.13,19.09 64.3,18.26 64.3,14.45 Q2.1
N$13
  Bottom 0.457: T4.C U$1.VCC_LED
N$14  (via drill 0.6)
  Top 0.457: v70.96,20.48 v91.12,20.48
  Bottom 0.457: IC2.12 71.02,17.25 70.64,17.62 70.64,20.16 v70.96,20.48 | U$1.SDI 90.01,28.1 90.01,26.2 89.7,25.88 89.7,25.24 90.01,24.93 90.01,22.07 91.12,20.96 v91.12,20.48
N$15
  Bottom 0.406: U1.16 93.42,32.95 94.46,31.91 100.49,31.91 101.11,31.29 U$2.D-
N$16
  Bottom 0.406: U1.15 92.77,32.33 93.82,31.27 100.17,31.27 100.81,30.64 U$2.D+
N$17  (via drill 0.6)
  Top 0.457: v62.39,4.29 v69.69,4.29
  Bottom 0.457: T1.E 68.79,6.71 D1.C | T1.E 68.74,6.51 | v69.69,4.29 69.69,5.7 T1.E | T2.B v62.39,4.29
N$18
  Bottom 0.457: IC4.6 102.08,52.86 102.08,54.77 103.35,56.04 103.98,56.04 R8.1
N$19
  Bottom 0.457: R17.2 50.19,16.35 GEIGER1.ANODE
N$20
  Bottom 0.457: T3.B 23.65,5.24 24.92,6.51 R20.2 | 26.51,6.51 R20.2 | C15.1 26.56,6.56 R20.2
N$21
  Bottom 0.457: IC4.7 102.39,51.59 103.03,52.23 R9.1
N$22
  Bottom 0.457: LED6.K 105.89,50.33 R9.2
N$23  (via drill 0.6)
  Top 0.457: v52.86,30.32 v50.33,30.32
  Bottom 0.457: JP3.3 50.33,50.64 53.5,47.47 53.5,44.29 50.01,40.8 50.01,30.32 v50.33,30.32 | IC2.32 52.9,30.29 v52.86,30.32
N$24
  Bottom 0.457: R8.2 106.21,54.45 LED5.K
N$25  (via drill 0.6)  (1 unrouted)
  Top 0.457: v80.17,51.28 v84.3,51.28
  Bottom 0.457: IC4.5 97.95,54.14 96.36,52.55 96.36,49.37 | 85.89,48.1 84.61,48.1 83.98,48.74 83.98,51.28 | v84.3,51.28 83.98,51.28 | 83.98,51.28 C10.2 83.93,53.5 83.34,53.5 81.12,55.72 R25.2 | 85.89,48.1 86.52,48.1 88.11,49.69 JP1.1 89.7,50.33 90.97,49.06 96.05,49.06 96.36,49.37 | 85.89,48.1 85.89,45.36 BATTERY1.VCC | Q4.2 R27.2 79.22,52.23 v80.17,51.28 | S2.2 105.85,46.79 105.25,46.2 103.35,46.2 100.49,49.06 96.68,49.06 96.36,49.37
N$26
  Bottom 0.406: U1.2 100.57,28.5 101.12,29.05 101.44,29.05 102.08,28.42 102.08,24.29 C12.1
N$27
  Bottom 0.457: R6.2 IC4.2
N$28
  Bottom 0.406: R13.2 103.03,23.66 103.03,28.42 101.76,29.69 100.81,29.69 99.92,28.8 U1.3
  Bottom 0.457: R13.2
N$29  (via drill 0.6)
  Top 0.457: v101.76,56.36 v101.76,50.33
  Bottom 0.457: R11.1 R12.1 92.23,56.04 91.55,56.72 C11.2 | R11.1 95.73,56.04 R10.1 R7.1 101.44,56.04 v101.76,56.36 | IC4.8 100.38,50.43 101.65,50.43 v101.76,50.33 | IC4.4 94.88,55.83 R11.1
N$30
  Bottom 0.457: Q2.2 62.71,16.35 63.03,16.67 63.03,18.26 64.66,19.89 IC2.19
N$31  (2 unrouted)
  Bottom 0.457: IC4.1 94.56,50.01 91.28,50.01 90.65,50.64 90.65,51.91 89.7,52.86 JP1.2 86.84,52.86 85.89,51.91 85.89,50.96 | 85.89,50.86 BATTERY1.TEMP
N$32  (via drill 0.6)
  Top 0.457: v64.3,27.15 v73.82,27.15 | v77.31,30.32 v77.31,26.83
  Bottom 0.457: JP3.5 48.74,45.56 50.64,47.47 51.91,47.47 52.55,46.83 52.55,44.93 49.06,41.44 49.06,28.1 50.01,27.15 v64.3,27.15 | v73.82,27.15 73.82,27.78 76.04,30.01 77,30.01 v77.31,30.32 | IC2.60 80.75,21.49 79.22,23.02 79.22,24.93 v77.31,26.83
N$33
  Bottom 0.457: IC2.44 76.62,37.68 R30.1
N$34  (via drill 0.6 pad 2)
  other vias: 1.03,1.03
N$35
  Bottom 0.457: U$3.3 69.13,50.61 U$5.P$2 66.06,47.54 D3.A
N$36
  Bottom 0.457: IC2.51 84.98,28.69 86.2,27.47 86.2,25.56 87.16,24.61 87.16,20.8 U$1.RESET
N$37  (via drill 0.6 pad 1.68)
  other vias: 37.76,9.42
N$38
  Bottom 0.457: IC2.50 85.45,29.49 87.16,27.78 87.16,25.88 U$1.D/C
N$39
  Bottom 0.457: IC2.49 85.92,30.29 88.74,27.47 U$1.CS
N$40
  Bottom 0.457: IC2.47 79.02,34.89 81.12,36.99 83.98,36.99 84.3,36.67 85.57,36.67 85.89,36.99 U$1.XP
N$41
  Bottom 0.457: IC2.46 78.22,35.36 80.81,37.94 83.34,37.94 84.93,39.53 U$1.YN
N$42  (via drill 0.6)
  Top 0.457: v34.77,6.51 v37.94,6.51
  Bottom 0.457: C15.2 30.91,4.56 R18.2 30.32,5.56 31.32,6.56 C16.1 34.72,6.56 v34.77,6.51 | GEIGER1.CATHODE 38.51,8.03 37.94,7.46 v37.94,6.51
N$43  (via drill 0.6)
  Top 0.457: v83.34,27.47 v83.34,39.53
  Bottom 0.457: IC2.54 82.81,26.29 83.34,26.83 v83.34,27.47 | v83.34,39.53 83.66,39.53 U$1.YP_ADC
N$44  (via drill 0.6)
  Top 0.457: v84.93,27.15 v84.93,37.94
  Bottom 0.457: IC2.55 83.28,25.49 v84.93,27.15 | v84.93,37.94 85.25,38.26 89.38,38.26 90.01,38.9 90.01,40.8 U$1.XN_ADC
N$45
  Bottom 0.457: T4.B 82.71,33.5 R24.2 82.61,33.5 80.81,33.5 79.82,32.51 IC2.48
N$46
  Bottom 0.457: Q4.1 76.99,54.13 77,54.14 77.31,54.13 R27.1 78.9,54.14 79.22,53.82 79.85,53.82 81.44,52.23 81.44,50.64 80.95,50.16 T6.C
N$47
  Bottom 0.457: C18.2 73.3,53.18 | Q4.3 73.3,53.18 | U$5.P$1 73.08,52.96 73.3,53.18
N$48  (via drill 0.6)
  Top 0.457: v88.74,47.78 v81.12,47.78
  Bottom 0.457: S2.1 106.48,41.79 100.49,47.78 v88.74,47.78 | v81.12,47.78 79.22,47.78 R28.2
N$49  (via drill 0.6 pad 2)
  other vias: 108.03,60.03
N$50  (via drill 0.6 pad 1.68)
  other vias: 3.75,22.64
N$51
  Bottom 0.457: D2.A 57.99,5.63 L1.2 58.8,8.25 T2.C
N$52  (via drill 0.6 pad 1.68)
  other vias: 3.75,9.42
N$53  (via drill 0.6 pad 2)
  other vias: 1.03,60.03
N$54  (via drill 0.6)
  Top 0.457: v51.59,21.75 v77.95,21.75
  Bottom 0.457: R15.1 40.48,5.24 41.75,6.51 42.66,6.51 C13.2 44.56,6.56 R16.1 44.61,20.48 45.25,21.12 49.69,21.12 50.33,21.75 v51.59,21.75 | IC2.61 79.96,20.69 78.9,21.75 v77.95,21.75
N$56
  Bottom 0.457: R15.2 47.78,6.51 | 47.78,6.51 R17.1 C14.1 | D2.C 51.59,5.56 50.64,6.51 47.78,6.51
N$57
  Bottom 0.457: R30.2 75.72,42.24 T7.B
N$59
  Bottom 0.457: T5.B R21.2 23.66,8.73 22.7,7.78 T3.C
N$60  (via drill 0.6)
  Top 0.457: v52.86,23.02 v70.96,23.02
  Bottom 0.457: T5.C 29.2,10.63 R19.1 30.32,17.3 32.55,19.53 39.53,19.53 42.7,22.7 46.83,22.7 47.47,22.07 49.37,22.07 50.33,23.02 v52.86,23.02 | v70.96,23.02 71.28,23.02 72.23,22.07 72.23,19.21 73.5,17.94 75.41,17.94 75.82,17.53 IC2.6
N$70  (via drill 0.9 pad 2)
  other vias: 108.03,1.03
POWER_CONTROL
  Bottom 0.457: T6.B R29.1 R28.1 79.22,45.56 79.22,40.48 77.42,38.69 IC2.45
RXLED
  Bottom 0.406: U1.22 97.32,37.94 96.68,38.58 96.68,39.85 R5.1
SOLDER_TUBE  (via drill 0.6)
  Top 0.457: v91.6,40.8 v77.8,40.8
  Bottom 0.457: v91.6,40.8 91.6,42.7 92.23,43.34 92.23,45.51 SP4.2 | T7.C 77.78,40.82 v77.8,40.8
TXLED
  Bottom 0.406: U1.23 97.97,37.97 98.59,38.58 R4.1
VCC_3.3V  (via drill 0.6)
  Top 0.457: v22.8,11.19 v22.8,23.73 | v85.25,19.21 v75.72,19.21 | v51.28,54.45 v51.28,46.2 | v48.1,26.83 v48.1,23.34
  Bottom 0.305: 84.3,6.51 84.3,9.37
  Bottom 0.457: SENSOR1.VCC 6.87,19.78 10.87,23.77 22.8,23.77 | 22.8,23.77 24.71,23.77 C17.2 24.74,24.09 26.03,25.38 26.68,25.38 | 27.97,25.38 28.61,25.38 28.62,25.38 | 27.97,25.38 26.68,25.38 | IC5.8 26.67,25.38 26.68,25.38 | IC5.5 28.62,25.38 | 27.97,25.38 IC5.6 27.97,23.45 27.32,22.8 IC5.2 | v22.8,23.73 22.8,23.77 | 28.62,25.38 30.5,25.38 R23.2 | T5.E R21.1 24.09,10.84 24.09,11.27 | 24.09,11.27 SENSOR2.VCC 24.29,12.62 24.29,13.18 33.18,22.07 R22.2 36.36,20.8 38.9,20.8 41.75,23.66 47.78,23.66 v48.1,23.34 49.37,23.34 50.33,24.29 55.72,24.29 52.86,21.43 52.86,17.94 54.77,16.04 56.99,16.04 | v22.8,11.19 24,11.19 24.09,11.27 | 56.99,16.04 60.8,16.04 62.07,17.3 62.07,18.58 64.99,21.49 IC2.21 67.53,21.49 70.33,24.29 71.28,24.29 73.19,22.38 73.19,19.53 73.5,19.21 v75.72,19.21 | C4.2 56.99,16.04 | 84.3,6.51 SV1.2 86.2,5.24 87.47,6.51 88.06,6.51 C5.2 88.16,6.51 102.71,6.51 | 84.3,9.37 83.66,10 R2.2 82.39,17.52 IC2.64 81.59,18.26 80.17,18.26 79.53,18.89 77.31,18.89 77,19.21 76.68,19.21 v75.72,19.21 | R24.1 82.71,35.4 T4.E 85.11,35.72 89.38,35.72 90.01,35.09 | 90.01,35.09 90.01,33.18 U$1.VCC 88.42,31.59 81.12,31.59 80.17,30.64 80.17,29.05 | WLAN1.VCC 103.67,4.84 103.67,5.56 102.71,6.51 | v48.1,26.83 JP3.6 v51.28,46.2 | R3.2 51.49,54.67 v51.28,54.45 51.28,54.14 53.5,51.91 56.04,51.91 58.56,54.43 IC3.2 61.39,54.72 C9.2 | IC2.52 80.7,27.89 80.17,28.42 80.17,29.05 | IC2.62 84.57,19.89 v85.25,19.21 | 80.17,29.05 76.36,29.05 75.09,27.78 75.09,26.2 76.04,25.24 76.04,23.02 75.72,22.7 v75.72,19.21 | WLAN1.CH_PD 101.7,16.09 102.71,15.08 102.71,11.91 103.67,10.95 103.67,7.46 102.71,6.51
  Bottom 0.457: 90.01,35.09 90.01,37.31 92.87,40.17 92.87,42.07 96.36,45.56 SP4.1
(copper drawn outside any net)
  shapes: Bottom area x208

### Text on the board
Bottom: D.1.0.100.61
tPlace: http://www.uradmonitor.com | uRADMonitor | serial number